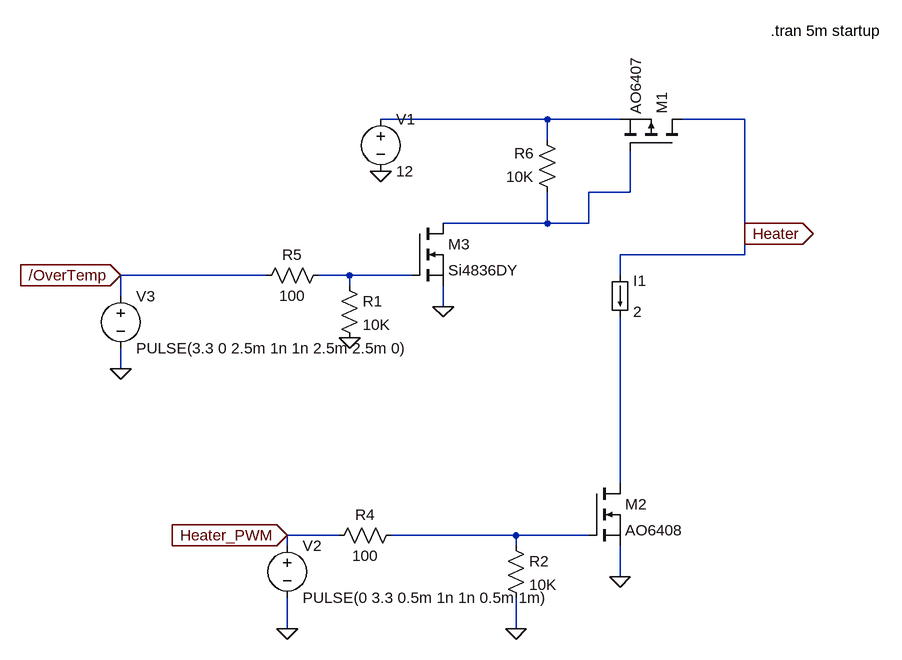
[diagram p0: schematic heater.asc]
heater.asc, the LTspice schematic file:
Version 4
SHEET 1 1372 944
WIRE 224 48 -32 48
WIRE 336 48 224 48
WIRE 528 48 432 48
WIRE 224 80 224 48
WIRE 352 160 352 96
WIRE 352 160 288 160
WIRE 224 208 224 160
WIRE 224 208 64 208
WIRE 288 208 288 160
WIRE 288 208 224 208
WIRE 528 224 528 48
WIRE 528 256 528 224
WIRE 528 256 336 256
WIRE -208 288 -432 288
WIRE -80 288 -128 288
WIRE 16 288 -80 288
WIRE 336 288 336 256
WIRE -80 304 -80 288
WIRE -432 320 -432 288
WIRE 64 336 64 304
WIRE -432 432 -432 400
WIRE 336 608 336 352
WIRE -96 688 -176 688
WIRE 176 688 -16 688
WIRE 288 688 176 688
WIRE -176 704 -176 688
WIRE 176 704 176 688
WIRE 336 752 336 704
WIRE -176 832 -176 784
WIRE 176 832 176 784
FLAG -80 384 0
FLAG 336 752 0
FLAG -32 128 0
FLAG -176 832 0
FLAG 176 832 0
FLAG -432 432 0
FLAG 64 336 0
FLAG 528 224 Heater
IOPIN 528 224 Out
FLAG -432 288 /OverTemp
IOPIN -432 288 In
FLAG -176 688 Heater_PWM
IOPIN -176 688 In
SYMBOL load 320 288 R0
SYMATTR InstName I1
SYMATTR Value 2
SYMATTR SpiceLine load
SYMBOL voltage -32 32 R0
SYMATTR InstName V1
SYMATTR Value 12
SYMBOL res -96 288 R0
SYMATTR InstName R1
SYMATTR Value 10K
SYMBOL res 160 688 R0
SYMATTR InstName R2
SYMATTR Value 10K
SYMBOL Res 0 672 R90
WINDOW 0 0 56 VBottom 2
WINDOW 3 32 56 VTop 2
SYMATTR InstName R4
SYMATTR Value 100
SYMBOL voltage -176 688 R0
SYMATTR InstName V2
SYMATTR Value PULSE(0 3.3 0.5m 1n 1n 0.5m 1m)
SYMBOL voltage -432 304 R0
SYMATTR InstName V3
SYMATTR Value PULSE(3.3 0 2.5m 1n 1n 2.5m 2.5m 0)
SYMBOL Res -112 272 R90
WINDOW 0 0 56 VBottom 2
WINDOW 3 32 56 VTop 2
SYMATTR InstName R5
SYMATTR Value 100
SYMBOL nmos 16 208 R0
SYMATTR InstName M3
SYMATTR Value Si4836DY
SYMBOL Res 240 176 R180
WINDOW 0 36 76 Left 2
WINDOW 3 36 40 Left 2
SYMATTR InstName R6
SYMATTR Value 10K
SYMBOL pmos 432 96 M270
SYMATTR InstName M1
SYMATTR Value AO6407
SYMBOL nmos 288 608 R0
SYMATTR InstName M2
SYMATTR Value AO6408
TEXT 568 -88 Left 2 !.tran 5m startup

The netlist it stands for:
* heater.asc
I1 Heater N004 2 load
V1 N001 0 12
R1 N003 0 10K
R2 N005 0 10K
R4 N005 Heater_PWM 100
V2 Heater_PWM 0 PULSE(0 3.3 0.5m 1n 1n 0.5m 1m)
V3 /OverTemp 0 PULSE(3.3 0 2.5m 1n 1n 2.5m 2.5m 0)
R5 N003 /OverTemp 100
M3 N002 N003 0 0 Si4836DY
R6 N002 N001 10K
M1 Heater N002 N001 N001 AO6407
M2 N004 N005 0 0 AO6408
.model NMOS NMOS
.model PMOS PMOS
.lib standard.mos
.tran 5m startup
.backanno
.end